# Altium schematic sheet Simple_Schematic.SchDoc
size A
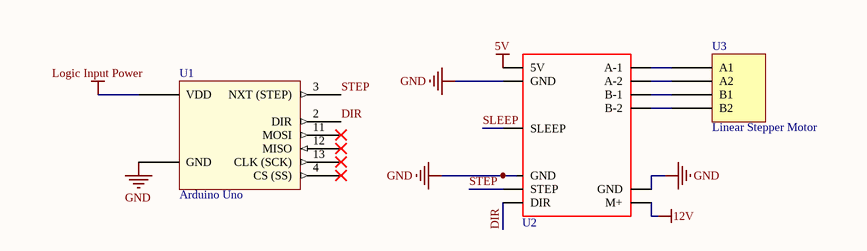
[diagram p0: Simple_Schematic.SchDoc]

## Parts
U1  Arduino Uno
U2  105990027  (value not drawn)
U3  Linear Stepper Motor

## Nets
5V: U2.?5(5V)
12V: U2.?7(M+)
GND: U1.1(GND) U2.?1(GND) U2.?6(GND) U2.?8(GND)
Logic Input Power: U1.0(VDD)
DIR: U1.2(DIR) U2.?3(DIR)
SLEEP: U2.?4(SLEEP)
STEP: U1.3(NXT_(STEP)) U2.?2(STEP)
NetU2_?9: U2.?9(A-1) U3.A1
NetU2_?10: U2.?10(A-2) U3.A2
NetU2_?11: U2.?11(B-1) U3.B1
NetU2_?12: U2.?12(B-2) U3.B2

Not connected (* = marked no-connect by the designer): U1 4(CS_(SS))* 11(MOSI)* 12(MISO)* 13(CLK_(SCK))*

## Library data of the parts
U2 = EasyDriver: EASY DRIVER STEPPER MOTOR DRIVER; Manufacturer: Seeed Technology Co.; Expanded Description: A3967 - Power Management, Motor Control, Stepper Evaluation Board; Load Supply Voltage Range: 5 to 30 V; Logic Supply Voltage Range: 3.0 to 5.5V; Input Current: +/- 20 uA; Maximum STEP Frequency: 500 kHz; Mounting Technology: Header; PartNumber: 105990027; DigiKey Part #: 1597-1403-ND; Website: http://www.schmalzhaus.com/EasyDriver/; Version: v4.5
U3 = Nema Non-captive Linear Stepper Motor: This is a linear stepper motor which named Nema 23 Non-captive linear actuator, it was composed of 56mm 2A Nema 23 stepper motor and 150mm length Tr11x2 linear screw.; Part Number: 23LS22-2004N-150T; Rated Current: 2.0A; Holding Torque: 1.2Nm; Recommended Voltage: 24-36V; ComponentLink1Description: Manufacturer URL; ComponentLink2URL: http://industrial.panasonic.com/www-data/pdf/AEA5000/AEA5000CE4.pdf; ComponentLink2Description: Datasheet; ComponentLink1URL: http://www.omc-stepperonline.com/nema-23-noncaptive-linear-stepper-motor-56mm-body-150mm-lead-screw-t11-x-2-p-150.html; Rated Current/phase: 2.0A; Weight: 650g